# EAGLE schematic SlotCar_v1.0 (1) (EAGLE 7.7.0)
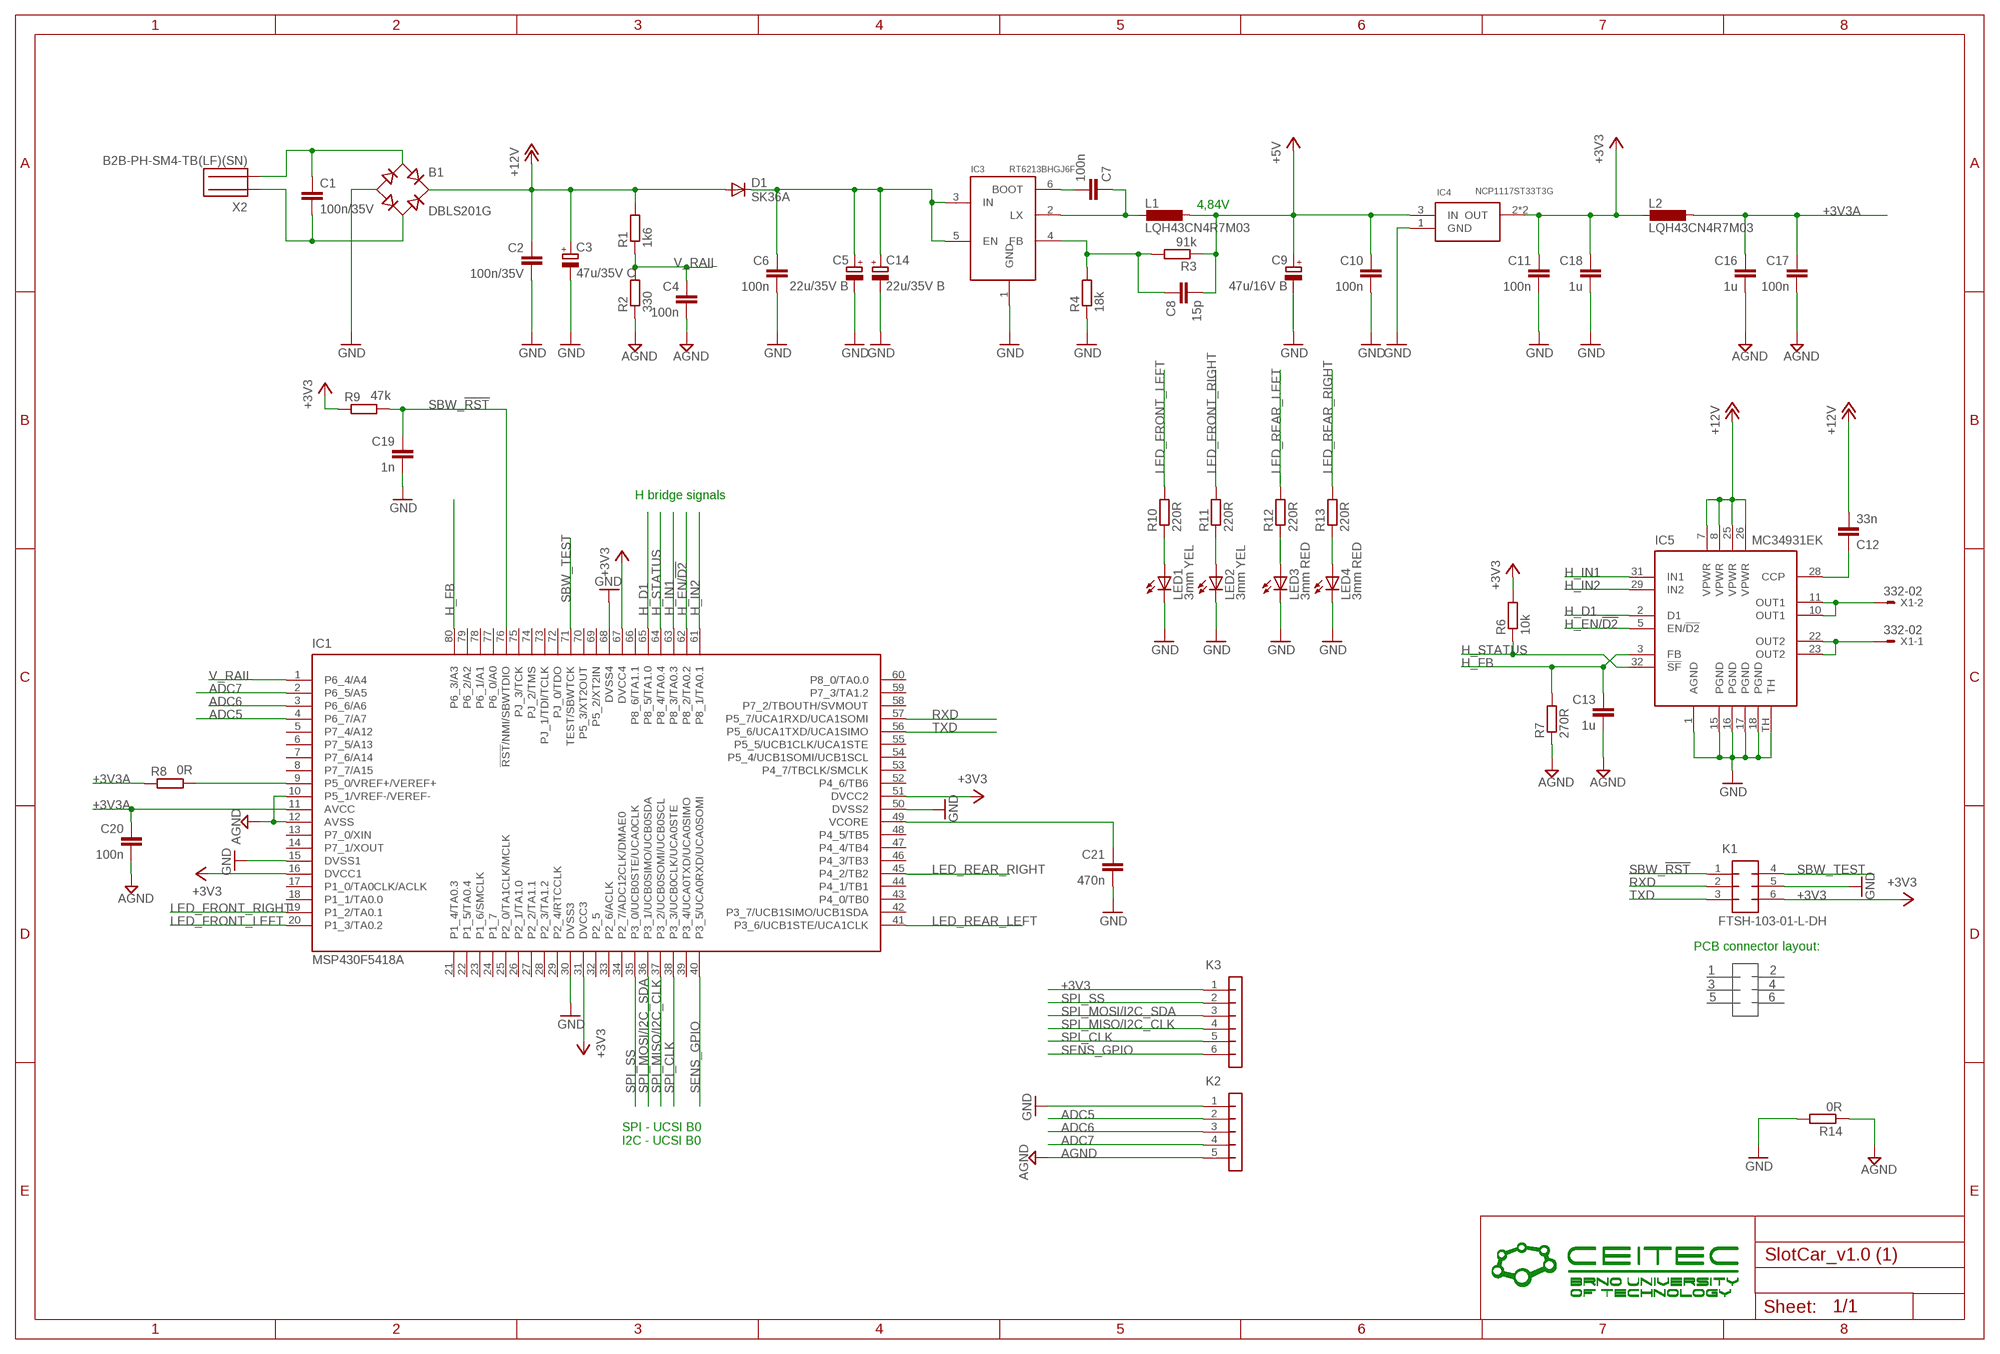
[diagram p0: schematic, sheet 1]

## Parts
B1  DBLS201G  [DBS]
C1  100n/35V  C-EUC0805K  [C0805K]
C2  100n/35V  C-EUC0805K  [C0805K]
C3  47u/35V C  CPOL-EU153CLV-0505  [153CLV-0505]
C4  100n  C-EUC0805K  [C0805K]
C5  22u/35V B  CPOL-EU153CLV-0405  [153CLV-0405]
C6  100n  C-EUC0805K  [C0805K]
C7  100n  C-EUC0805K  [C0805K]
C8  15p  C-EUC0805K  [C0805K]
C9  47u/16V B  CPOL-EU153CLV-0405  [153CLV-0405]
C10  100n  C-EUC0805K  [C0805K]
C11  100n  C-EUC0805K  [C0805K]
C12  33n  C-EUC0805K  [C0805K]
C13  1u  C-EUC0805K  [C0805K]
C14  22u/35V B  CPOL-EU153CLV-0405  [153CLV-0405]
C16  1u  C-EUC0805K  [C0805K]
C17  100n  C-EUC0805K  [C0805K]
C18  1u  C-EUC0805K  [C0805K]
C19  1n  C-EUC0805K  [C0805K]
C20  100n  C-EUC0805K  [C0805K]
C21  470n  C-EUC0805K  [C0805K]
D1  SK36A  DIODE-DO214AC  [DO214AC]
IC1  MSP430F5418A  [PN_S-PQFP-G80]
IC3  RT6213BHGJ6F  [SOT23-6]
IC4  NCP1117ST33T3G  [SOT223]
IC5  MC34931EK  [SOIC32W]
K1  FTSH-103-01-L-DH  [PINHEAD_2X3_RM1.27]
K2  PIN_1X5_SMD  [PINHEAD_1X5_RM1.27SMD]
K3  PIN_1X6_SMD  [PINHEAD_1X6_RM1.27SMD]
L1  LQH43CN4R7M03  L-EUL1812  [L1812]
L2  LQH43CN4R7M03  L-EUL1812  [L1812]
LED1  3mm YEL  LED3MM  [LED3MM]
LED2  3mm YEL  LED3MM  [LED3MM]
LED3  3mm RED  LED3MM  [LED3MM]
LED4  3mm RED  LED3MM  [LED3MM]
R1  1k6  R-EU_M0805  [M0805]
R2  330  R-EU_M0805  [M0805]
R3  91k  R-EU_M0805  [M0805]
R4  18k  R-EU_M0805  [M0805]
R6  10k  R-EU_M0805  [M0805]
R7  270R  R-EU_M0805  [M0805]
R8  0R  R-EU_M0805  [M0805]
R9  47k  R-EU_M0805  [M0805]
R10  220R  R-EU_M0805  [M0805]
R11  220R  R-EU_M0805  [M0805]
R12  220R  R-EU_M0805  [M0805]
R13  220R  R-EU_M0805  [M0805]
R14  0R  R-EU_M0805  [M0805]
X1  332-02  [332-02]
X2  B2B-PH-SM4-TB(LF)(SN)  JST-2P-2.00MM-90DEG  [JST-2.00MM-2P]

## Nets
+3V3: C11.1 C18.1 IC1.16(DVCC1) IC1.31(DVCC3) IC1.51(DVCC2) IC1.67(DVCC4) IC4.2(OUT) IC4.4(OUT) K1.6 K3.1 L2.2 R6.2 R9.1
+3V3A: C16.1 C17.1 C20.1 IC1.11(AVCC) L2.1 R8.1
+5V: C8.2 C9.+ C10.1 IC4.3(IN) L1.1 R3.1
+12V: B1.+ C2.1 C3.+ C12.2 D1.A IC5.7(VPWR) IC5.8(VPWR) IC5.25(VPWR) IC5.26(VPWR) R1.2
ADC5: IC1.4(P6_7/A7) K2.2
ADC6: IC1.3(P6_6/A6) K2.3
ADC7: IC1.2(P6_5/A5) K2.4
AGND: C4.2 C13.2 C16.2 C17.2 C20.2 IC1.10(P5_1/VREF-/VEREF-) IC1.12(AVSS) K2.5 R2.1 R7.1 R14.1
GND: B1.- C2.2 C3.- C5.- C6.2 C9.- C10.2 C11.2 C14.- C18.2 C19.2 C21.2 IC1.15(DVSS1) IC1.30(DVSS3) IC1.50(DVSS2) IC1.68(DVSS4) IC3.1(GND) IC4.1(GND) IC5.1(AGND) IC5.15(PGND) IC5.16(PGND) IC5.17(PGND) IC5.18(PGND) IC5.TH K1.5 K2.1 LED1.K(C) LED2.K(C) LED3.K(C) LED4.K(C) R4.1 R14.2
H_D1: IC1.65(P8_5/TA1.0) IC5.2(D1)
H_EN/!D2: IC1.62(P8_2/TA0.2) IC5.5(EN/!D2)
H_FB: C13.1 IC1.80(P6_3/A3) IC5.3(FB) R7.2
H_IN1: IC1.63(P8_3/TA0.3) IC5.31(IN1)
H_IN2: IC1.61(P8_1/TA0.1) IC5.29(IN2)
H_STATUS: IC1.64(P8_4/TA0.4) IC5.32(!SF) R6.1
LED_FRONT_LEFT: IC1.20(P1_3/TA0.2) R10.2
LED_FRONT_RIGHT: IC1.19(P1_2/TA0.1) R11.2
LED_REAR_LEFT: IC1.41(P3_6/UCB1STE/UCA1CLK) R12.2
LED_REAR_RIGHT: IC1.45(P4_2/TB2) R13.2
N$1: IC5.10(OUT1) IC5.11(OUT1) X1.2
N$2: B1.AC2 C1.2 X2.1
N$3: B1.AC1 C1.1 X2.2
N$4: IC5.22(OUT2) IC5.23(OUT2) X1.1
N$5: C12.1 IC5.28(CCP)
N$6: C7.2 IC3.6(BOOT)
N$7: C7.1 IC3.2(LX) L1.2
N$8: C8.1 IC3.4(FB) R3.2 R4.2
N$9: LED1.A R10.1
N$10: IC1.9(P5_0/VREF+/VEREF+) R8.2
N$11: LED2.A R11.1
N$12: LED3.A R12.1
N$13: LED4.A R13.1
N$14: C21.1 IC1.49(VCORE)
N$15: C5.+ C6.1 C14.+ D1.C IC3.3(IN) IC3.5(EN)
RXD: IC1.57(P5_7/UCA1RXD/UCA1SOMI) K1.2
SBW_!RST: C19.1 IC1.76(!RST!/NMI/SBWTDIO) K1.1 R9.2
SBW_TEST: IC1.71(TEST/SBWTCK) K1.4
SENS_GPIO: IC1.40(P3_5/UCA0RXD/UCA0SOMI) K3.6
SPI_CLK: IC1.38(P3_3/UCB0CLK/UCA0STE) K3.5
SPI_MISO/I2C_CLK: IC1.37(P3_2/UCB0SOMI/UCB0SCL) K3.4
SPI_MOSI/I2C_SDA: IC1.36(P3_1/UCB0SIMO/UCB0SDA) K3.3
SPI_SS: IC1.35(P3_0/UCB0STE/UCA0CLK) K3.2
TXD: IC1.56(P5_6/UCA1TXD/UCA1SIMO) K1.3
V_RAIL: C4.1 IC1.1(P6_4/A4) R1.1 R2.2
Unconnected: IC1.5(P7_4/A12) IC1.6(P7_5/A13) IC1.7(P7_6/A14) IC1.8(P7_7/A15) IC1.13(P7_0/XIN) IC1.14(P7_1/XOUT) IC1.17(P1_0/TA0CLK/ACLK) IC1.18(P1_1/TA0.0) IC1.21(P1_4/TA0.3) IC1.22(P1_5/TA0.4) IC1.23(P1_6/SMCLK) IC1.24(P1_7) IC1.25(P2_0/TA1CLK/MCLK) IC1.26(P2_1/TA1.0) IC1.27(P2_2/TA1.1) IC1.28(P2_3/TA1.2) IC1.29(P2_4/RTCCLK) IC1.32(P2_5) IC1.33(P2_6/ACLK) IC1.34(P2_7/ADC12CLK/DMAE0) IC1.39(P3_4/UCA0TXD/UCA0SIMO) IC1.42(P3_7/UCB1SIMO/UCB1SDA) IC1.43(P4_0/TB0) IC1.44(P4_1/TB1) IC1.46(P4_3/TB3) IC1.47(P4_4/TB4) IC1.48(P4_5/TB5) IC1.52(P4_6/TB6) IC1.53(P4_7/TBCLK/SMCLK) IC1.54(P5_4/UCB1SOMI/UCB1SCL) IC1.55(P5_5/UCB1CLK/UCA1STE) IC1.58(P7_2/TBOUTH/SVMOUT) IC1.59(P7_3/TA1.2) IC1.60(P8_0/TA0.0) IC1.66(P8_6/TA1.1) IC1.69(P5_2/XT2IN) IC1.70(P5_3/XT2OUT) IC1.72(PJ_0/TDO) IC1.73(PJ_1/TDI/TCLK) IC1.74(PJ_2/TMS) IC1.75(PJ_3/TCK) IC1.77(P6_0/A0) IC1.78(P6_1/A1) IC1.79(P6_2/A2)

## Notes on the sheet
- 4,84V
- H bridge signals
- PCB connector layout:
- 1 | 2
- 3 | 4
- 5 | 6
- SPI - UCSI B0
  I2C - UCSI B0

## Library data of the parts
B1 = rectifier:DB?*G: Single Phase 1.0 AMP Glass Passivated Bridge Rectifier Taiwan Semiconductor Co.,Ltd. - TSC Source: http://www.taiwansemi.com/TSCbig5/ezcatfiles/cust/img/img/db101g.pdf http://www.ts.com.tw/db/pictures/modules/PDT/PDT060207001/DBLS201G.pdf
C1 C2 C4 C6-C8 C10-C13 C16-C21 = rcl:C-EU: CAPACITOR, European symbol
C3 C5 C9 C14 = rcl:CPOL-EU: POLARIZED CAPACITOR, European symbol
D1 = diode:DIODE-: DIODE
IC1 = texas:MSP430F5*: MIXED SIGNAL MICROCONTROLLER Auto generated by make-symbol-device-package-bsdl.ulp Rev. 27 Source: www.ti.com .. msp430f5437.pdf; MPN: MSP430F5418AIPN; OC_FARNELL: 1740334; OC_NEWARK: 68R9290
IC3 = _dos:RT6213BHGJ6F
IC4 = _dos:NCP1117ST33T3G
IC5 = _dos:MC34931EK: 5,0A H bridge. • 5.0 V to 36 V continuous operation with 24 V nominal operating voltage (transient operation from 5.0 V to 40 V) • 235 mΩ maximum RDS(on) at TJ = 150 °C (each H-Bridge MOSFET) • 3.0 V and 5.0 V TTL/CMOS logic compatible inputs • Overcurrent limiting (regulation) via internal constant-off-time PWM • Output short-circuit protection (short to VPWR or GND) • Temperature-dependant current-limit threshold reduction • All inputs have an internal source/sink to define the default (floating input) states • Sleep mode with current draw < 20 µA
K1 = _dos:FTSH-103-01-L-DH
K2 = _dos:PIN_1X5_SMD
K3 = _dos:PIN_1X6_SMD
L1 L2 = rcl:L-EU: INDUCTOR, European symbol
LED1-LED4 = led:LED: LED OSRAM: - CHIPLED LG R971, LG N971, LY N971, LG Q971, LY Q971, LO R971, LY R971 LH N974, LH R974 LS Q976, LO Q976, LY Q976 LO Q996 - Hyper CHIPLED LW Q18S LB Q993, LB Q99A, LB R99A - SideLED LS A670, LO A670, LY A670, LG A670, LP A670 LB A673, LV A673, LT A673, LW A673 LH A674 LY A675 LS A676, LA A676, LO A676, LY A676, LW A676 LS A679, LY A679, LG A679 - Hyper Micro SIDELED® LS Y876, LA Y876, LO Y876, LY Y876 LT Y87S - SmartLED LW L88C, LW L88S LB L89C, LB L89S, LG L890 LS L89K, LO L89K, LY L89K LS L896, LA L896, LO L896, LY L896 - TOPLED LS T670, LO T670, LY T670, LG T670, LP T670 LSG T670, LSP T670, LSY T670, LOP T670, LYG T670 LG T671, LOG T671, LSG T671 LB T673, LV T673, LT T673, LW T673 LH T674 LS T676, LA T676, LO T676, LY T676, LB T676, LH T676, LSB T676, LW T676 LB T67C, LV T67C, LT T67C, LS T67K, LO T67K, LY T67K, LW E67C LS E67B, LA E67B, LO E67B, LY E67B, LB E67C, LV E67C, LT E67C LW T67C LS T679, LY T679, LG T679 LS T770, LO T770, LY T770, LG T770, LP T770 LB T773, LV T773, LT T773, LW T773 LH T774 LS E675, LA E675, LY E675, LS T675 LS T776, LA T776, LO T776, LY T776, LB T776 LHGB T686 LT T68C, LB T68C - Hyper Mini TOPLED® LB M676 - Mini TOPLED Santana® LG M470 LS M47K, LO M47K, LY M47K Source: http://www.osram.convergy.de LUXEON: - LUMILED® LXK2-PW12-R00, LXK2-PW12-S00, LXK2-PW14-U00, LXK2-PW14-V00 LXK2-PM12-R00, LXK2-PM12-S00, LXK2-PM14-U00 LXK2-PE12-Q00, LXK2-PE12-R00, LXK2-PE12-S00, LXK2-PE14-T00, LXK2-PE14-U00 LXK2-PB12-K00, LXK2-PB12-L00, LXK2-PB12-M00, LXK2-PB14-N00, LXK2-PB14-P00, LXK2-PB14-Q00 LXK2-PR12-L00, LXK2-PR12-M00, LXK2-PR14-Q00, LXK2-PR14-R00 LXK2-PD12-Q00, LXK2-PD12-R00, LXK2-PD12-S00 LXK2-PH12-R00, LXK2-PH12-S00 LXK2-PL12-P00, LXK2-PL12-Q00, LXK2-PL12-R00 Source: www.luxeon.com KINGBRIGHT: KA-3528ASYC Source: www.kingbright.com
R1-R4 R6-R14 = rcl:R-EU_: RESISTOR, European symbol
X1 = con-garry:332-02: 2 Pin - 2mm Dual Row Source: www.mpe-connector.de / garry_shortform_2012.pdf
X2 = _dos:JST-2P-2.00MM-90DEG